# Altium project acopians-hw.PrjPcb
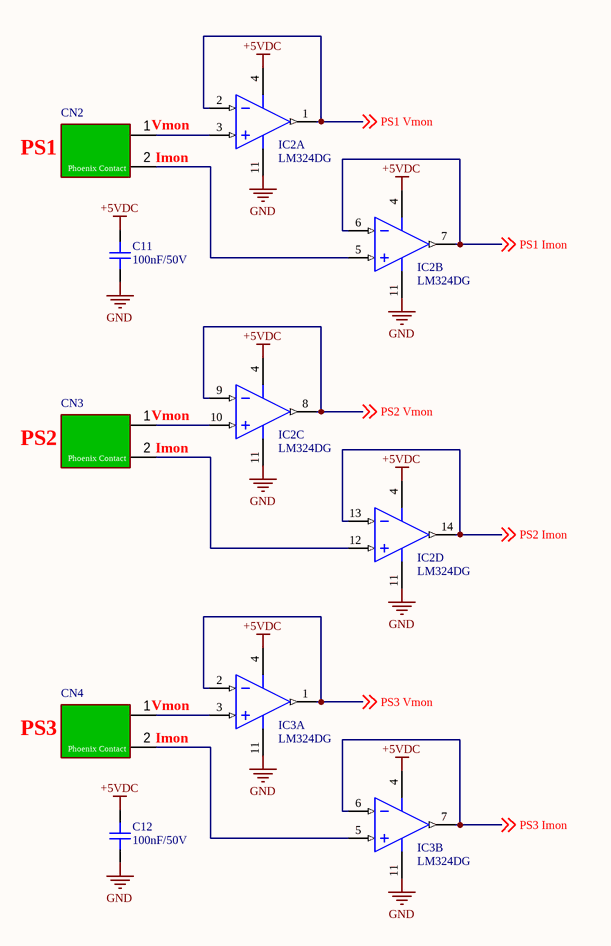
[diagram p0: vmon-and-imon-measurements-hw.SchDoc]
Project Link: =ProjectLink
2 sheets, 25 parts. Net scope: global (net labels, ports and power ports of the same name join across sheets).
Board file: pcb-power-supply-measurement-hw.PcbDoc
Sheets:
  vmon-and-imon-measurements-hw.SchDoc
  outputs-voltage-and-current-measurements-hw.SchDoc

## Sheet vmon-and-imon-measurements-hw.SchDoc
size A4; DrawnBy: Rogério J. M.; Revision: V1.0; SheetNumber: 2; SheetTotal: 5

### Parts
C11  100nF/50V  [C0805]
C12  100nF/50V  [C0805]
CN2  1755736  [Conector Phoenix 2 vias 1755736]  (value not drawn)
CN3  1755736  [Conector Phoenix 2 vias 1755736]  (value not drawn)
CN4  1755736  [Conector Phoenix 2 vias 1755736]  (value not drawn)
IC2  LM324DG  [SOIC-14]  (parts A,B,C,D of 4)
IC3  LM324DG  [SOIC-14]  (parts A,B of 4)

### Nets
+5VDC: C11.2 C12.2 IC2.4(V+) IC3.4(V+)
GND: C11.1 C12.1 IC2.11(V-) IC3.11(V-)
PS1 Imon: IC2.6(IN_B-) IC2.7(OUT_B) ; off-sheet PS1 Imon
PS1 Vmon: IC2.1(OUT_A) IC2.2(IN_A-) ; off-sheet PS1 Vmon
PS2 Imon: IC2.13(IN_D-) IC2.14(OUT_D) ; off-sheet PS2 Imon
PS2 Vmon: IC2.8(OUT_C) IC2.9(IN_C-) ; off-sheet PS2 Vmon
PS3 Imon: IC3.6(IN_B-) IC3.7(OUT_B) ; off-sheet PS3 Imon
PS3 Vmon: IC3.1(OUT_A) IC3.2(IN_A-) ; off-sheet PS3 Vmon
NetCN2_1: CN2.1 IC2.3(IN_A+)
NetCN2_2: CN2.2 IC2.5(IN_B+)
NetCN3_1: CN3.1 IC2.10(IN_C+)
NetCN3_2: CN3.2 IC2.12(IN_D+)
NetCN4_1: CN4.1 IC3.3(IN_A+)
NetCN4_2: CN4.2 IC3.5(IN_B+)

### Notes on the sheet
- PS1
- (near CN2) Vmon
- (near CN2) Imon
- (near CN3) Vmon
- PS2
- (near CN3) Imon
- (near CN4) Vmon
- PS3
- (near CN4) Imon
- Drawn by:
- Title:
- Revision:
- File:
- Date:
- Project:
- Time:
- Variant:
- Sheet
- of
- DAT - INE - EMI
  Eletrônica e
  Microeletrônica
- Copyright CNPEM 2023.
  This documentation describes Open Hardware and is licensed under the CERN OHL S v2. You may redistribute and modify this documentation under the terms of the CERN OHL S v2. (https://www.ohwr.org/cernohl). This documentation is distributed WITHOUT ANY EXPRESS OR IMPLIED WARRANTY, INCLUDING OF MERCHANTABILITY, SATISFACTORY QUALITY AND FITNESS FOR A PARTICULAR PURPOSE. Please see the CERN OHL S v2 for applicable conditions.

### Library data of the parts
C11 C12 = CAPACITOR 100nF/50V: Capacitor 0.1UF 50V X7R 0805; Manufacturer 1: Kyocera AVX; Manufacturer Part Number 1: 08055C104KAZ2A; Description 1: Capacitor Ceramic 0.1uF 50V X7R 10% SMD 0805 FlexiTerm 125C Paper T/R; Category 1: Ceramic Capacitors; Capacitance: 100nF; Tolerance: 10%; Temperature Coefficient: 30ppm/°C; Dissipation Factor: 2.5%; Código LNLS: AP106675; Supplier 1: Arrow Electronics; Supplier Part Number 1: 08055C104KAZ2A; RoHS 1: Yes; Stock 1: 28000; Pricing 1: 4000=0,0262 (USD); Mount: Surface Mount,PCB; Case/Package: 0805; Number of Pins: 2; Case Code (Metric): 2012; Case Code (Imperial): 0805; Min Operating Temperature: -55°C; Max Operating Temperature: 125°C; Packaging: Tape and Reel; Voltage Rating (DC): 50V; Dielectric: X7R; Package Quantity: 4000; Series: FLEXITERM®; Voltage Rating: 50V; Termination: SMD/SMT; Voltage: 50V; Features: Soft Termination; Construction: Flat; Length: 2.01mm; Width: 1.25mm; Height: 0.94mm; Depth: 1.25mm; Reach SVHC Compliant: No; Lead Free: Lead Free; RoHS Compliant: Yes; ComponentLink1URL: https://datasheet.ciiva.com/28613/630895-28613376.pdf?src-supplier=Element14; ComponentLink1Description: https://datasheet.ciiva.com/28613/630895-28613376.pdf?src-supplier=Element14; ComponentLink2URL: https://datasheet.ciiva.com/11788/0900766b80dc2409-11788550.pdf?src-supplier=Rs; ComponentLink2Description: https://datasheet.ciiva.com/11788/0900766b80dc2409-11788550.pdf?src-supplier=Rs; ComponentLink3URL: https://datasheet.ciiva.com/30514/2014094-30514066.pdf?src-supplier=Jameco; ComponentLink3Description: https://datasheet.ciiva.com/30514/2014094-30514066.pdf?src-supplier=Jameco; ComponentLink4URL: https://datasheet.ciiva.com/11499/flexiterm-11499901.pdf?src-supplier=Avnet; ComponentLink4Description: https://datasheet.ciiva.com/11499/flexiterm-11499901.pdf?src-supplier=Avnet; ComponentLink5URL: https://datasheet.ciiva.com/5417/cx7r-218113-5417323.pdf?src-supplier=Mouser; ComponentLink5Description: https://datasheet.ciiva.com/5417/cx7r-218113-5417323.pdf?src-supplier=Mouser; ComponentLink6URL: https://datasheet.ciiva.com/28613/630895-28613368.pdf?src-supplier=Element14; ComponentLink6Description: https://datasheet.ciiva.com/28613/630895-28613368.pdf?src-supplier=Element14; ComponentLink7URL: https://datasheet.ciiva.com/151/flexiterm-151512.pdf?src-supplier=Digi-Key; ComponentLink7Description: https://datasheet.ciiva.com/151/flexiterm-151512.pdf?src-supplier=Digi-Key; ComponentLink8URL: https://datasheet.ciiva.com/151/flexiterm-151513.pdf?src-supplier=Digi-Key; ComponentLink8Description: https://datasheet.ciiva.com/151/flexiterm-151513.pdf?src-supplier=Digi-Key; ComponentLink9URL: https://datasheet.ciiva.com/151/flexiterm-151514.pdf?src-supplier=Digi-Key; ComponentLink9Description: https://datasheet.ciiva.com/151/flexiterm-151514.pdf?src-supplier=Digi-Key; ComponentLink10URL: https://datasheet.ciiva.com/14602/70001075-14602617.pdf?src-supplier=Allied+Electronics; ComponentLink10Description: https://datasheet.ciiva.com/14602/70001075-14602617.pdf?src-supplier=Allied+Electronics; ComponentLink11URL: https://datasheet.ciiva.com/16427/cx7r-16427406.pdf?src-supplier=Future+Electronics; ComponentLink11Description: https://datasheet.ciiva.com/16427/cx7r-16427406.pdf?src-supplier=Future+Electronics
CN2-CN4 = CONECTOR PHOENIX 2 VIAS 1755736: Manufacturer: Phoenix Contact; Number of Positions: 2; Number of Levels: 1; Pitch: 0.200" (5.08mm); Header Orientation: Vertical; Current - IEC: 12A; Voltage - IEC: 630V; Voltage - UL: 300V; Material Flammability Rating: UL94 V-0; Contact Tail Length: 0.154" (3.90mm); Código LNLS: MT101663; Supplier 1: Digi-Key; Manufacturer Part Number: 1755736; RoHS: RoHS Compliant; Category: Connectors, Interconnects; Stock 1: 11008; Pricing 1: 1=0.59, 10=0.564, 50=0.539, 100=0.5243, 250=0.49, 500=0.4508, 1000=0.4165, 2500=0.3969, 5000=0.3724 (USD); Packaging: Bulk; Part Status: Active; Type: Header, Male Pins, Shrouded (4 Side); Positions Per Level: 2; Plug Wire Entry: -; Termination Style: Solder; Mounting Type: Through Hole; Current - UL: 12A; Wire Gauge or Range - AWG: -; Wire Gauge or Range - mm²: -; Color: Green; Operating Temperature: -; Contact Mating Finish: Tin; Features: -; Ingress Protection: -; Screw Size: -; Torque - Screw: -; Wire Strip Length: -; Contact Material: -; Housing Material: Polyamide (PA), Nylon; Insulation Height: 0.472" (12.00mm); ComponentLink1URL: http://media.digikey.com/pdf/Data%20Sheets/Phoenix%20Contact%20PDFs/1755736.pdf; ComponentLink1Description: http://media.digikey.com/pdf/Data%20Sheets/Phoenix%20Contact%20PDFs/1755736.pdf; Supplier Part Number 1: 277-1150-ND
IC2 IC3 = LM324DG: Operational Amplifiers - Op Amps 3-32V Quad 5mV; Manufacturer 1: Texas Instruments; Manufacturer Part Number 1: LM324DG4; Description 1: 4-Channel industry standard operational amplifier 14-SOIC 0 to 70; Category 1: Amplifiers - Op Amps, Buffer, Instrumentation; Operating Supply Voltage: 16V; Voltage Gain: 100dB; Slew Rate: 0.5V/µs; Common Mode Rejection Ratio: 65dB; Number of Channels: 4; Output Current: 30mA; Max Supply Voltage: 32V; Min Supply Voltage: 3V; Min Dual Supply Voltage: 1.5V; Gain Bandwidth Product: 1.2MHz; Input Bias Current: 20nA; Input Offset Voltage (Vos): 3mV; Operating Supply Current: 1.4mA; Output Current per Channel: 60mA; Amplifier Type: GENERAL PURPOSE; Supply Current: 3mA; Código LNLS: MT104472; Supplier 1: Mouser; Supplier Part Number 1: 595-LM324DG4; RoHS 1: Yes; Stock 1: 4026; Pricing 1: 1=0,9, 10=0,761, 50=0,761, 100=0,583, 1000=0,407, 10000=0,381 (USD); Mount: Surface Mount; Case/Package: SOIC; Number of Pins: 14; Min Operating Temperature: 0°C; Max Operating Temperature: 70°C; Package Quantity: 50; Packaging: Rail/Tube; Max Dual Supply Voltage: 16V; Number of Circuits: 4; Bandwidth: 1.2MHz; Technology: BIPOLAR; Radiation Hardening: No; Lead Free: Lead Free; RoHS Compliant: Yes; ComponentLink1URL: https://datasheet.ciiva.com/1811/lm224-1811004.pdf?src-supplier=Digi-Key; ComponentLink1Description: https://datasheet.ciiva.com/1811/lm224-1811004.pdf?src-supplier=Digi-Key

## Sheet outputs-voltage-and-current-measurements-hw.SchDoc
size A4; DrawnBy: Rogério J. M.; Revision: V1.0; SheetNumber: 3; SheetTotal: 5
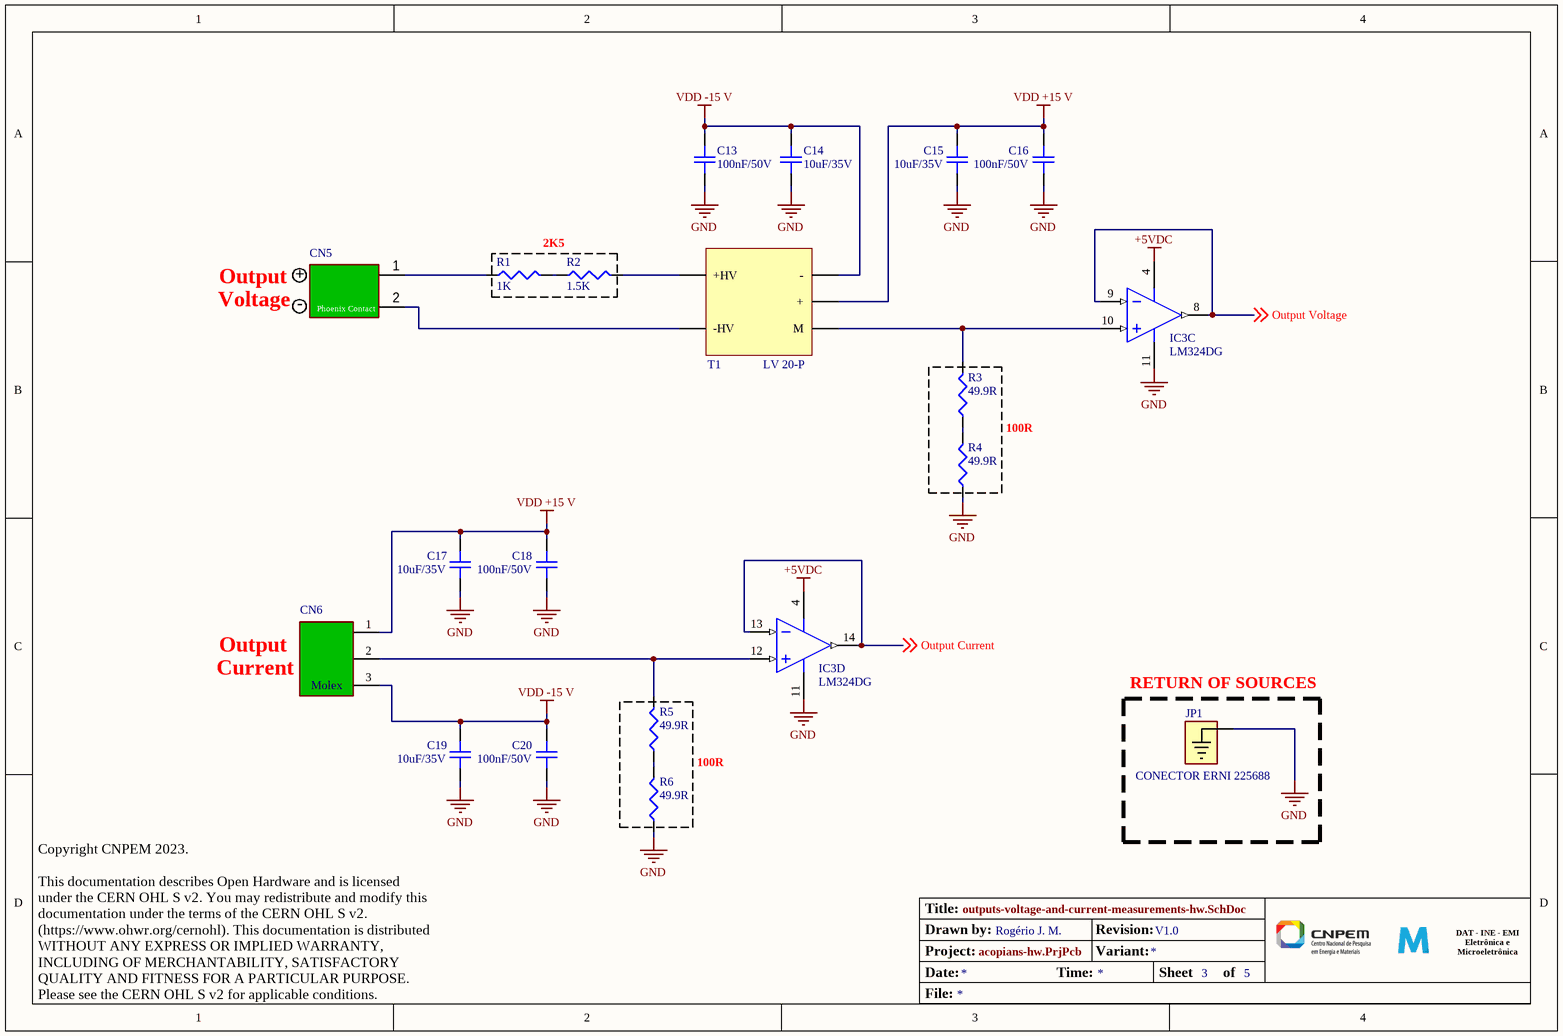
[diagram p1: outputs-voltage-and-current-measurements-hw.SchDoc]

### Parts
C13  100nF/50V  [C0805]
C14  10uF/35V  [C0805]
C15  10uF/35V  [C0805]
C16  100nF/50V  [C0805]
C17  10uF/35V  [C0805]
C18  100nF/50V  [C0805]
C19  10uF/35V  [C0805]
C20  100nF/50V  [C0805]
CN5  1755736  [Conector Phoenix 2 vias 1755736]  (value not drawn)
CN6  Header Molex 3 Pin 22-27-2031  [HEADER MOLEX 22 27 2031]  (value not drawn)
IC3  LM324DG  [SOIC-14]  (parts C,D of 4)
JP1  CONECTOR ERNI 225688  [CONECTOR ERNI 225688]
R1  1K  [R0805]
R2  1.5K  [R0603]
R3  49.9R  [R0603]
R4  49.9R  [R0603]
R5  49.9R  [R0603]
R6  49.9R  [R0603]
T1  Text: LV 20-P  [VOLTAGE TRANSDUCER LV 20-P]  (hidden comment: Voltagem Transducer LV 20-P)

### Blocks framed on the sheet
2K5: R1 R2
RETURN OF SOURCES: JP1

### Nets
+5VDC: IC3.4(V+)
GND: C13.1 C14.1 C15.1 C16.1 C17.1 C18.1 C19.1 C20.1 IC3.11(V-) JP1.1 R4.1 R6.1
VDD +15 V: C15.2 C16.2 C17.2 C18.2 CN6.1(+15V) T1.4(+)
VDD -15 V: C13.2 C14.2 C19.2 C20.2 CN6.3(-15V) T1.3(-)
Output Current: IC3.13(IN_D-) IC3.14(OUT_D) ; off-sheet Output Current
Output Voltage: IC3.8(OUT_C) IC3.9(IN_C-) ; off-sheet Output Voltage
NetCN5_1: CN5.1 R1.1
NetCN5_2: CN5.2 T1.2(-HV)
NetCN6_2: CN6.2(M) IC3.12(IN_D+) R5.2
NetIC3_10: IC3.10(IN_C+) R3.2 T1.5(M)
NetR1_2: R1.2 R2.1
NetR2_2: R2.2 T1.1(+HV)
NetR3_1: R3.1 R4.2
NetR5_1: R5.1 R6.2

### Notes on the sheet
- Voltage
- Output
- +
- -
- 100R
- Current
- Drawn by:
- Title:
- Revision:
- File:
- Date:
- Project:
- Time:
- Variant:
- Sheet
- of
- DAT - INE - EMI
  Eletrônica e
  Microeletrônica
- Copyright CNPEM 2023.
  This documentation describes Open Hardware and is licensed under the CERN OHL S v2. You may redistribute and modify this documentation under the terms of the CERN OHL S v2. (https://www.ohwr.org/cernohl). This documentation is distributed WITHOUT ANY EXPRESS OR IMPLIED WARRANTY, INCLUDING OF MERCHANTABILITY, SATISFACTORY QUALITY AND FITNESS FOR A PARTICULAR PURPOSE. Please see the CERN OHL S v2 for applicable conditions.
- (in symbol HEADER MOLEX 22-27-2031) Molex

### Library data of the parts
C13 C16 C18 C20 = CAPACITOR 100nF/50V: as C11 on sheet vmon-and-imon-measurements-hw; Supplier 1: Arrow Electronics; Supplier Part Number 1: 08055C104KAZ2A; RoHS 1: Yes; Stock 1: 28000; Pricing 1: 4000=0,0262 (USD); Mount: Surface Mount,PCB; Case/Package: 0805; Number of Pins: 2; Case Code (Metric): 2012; Case Code (Imperial): 0805; Min Operating Temperature: -55°C; Max Operating Temperature: 125°C; Packaging: Tape and Reel; Voltage Rating (DC): 50V; Dielectric: X7R; Package Quantity: 4000; Series: FLEXITERM®; Voltage Rating: 50V; Termination: SMD/SMT; Voltage: 50V; Features: Soft Termination; Construction: Flat; Length: 2.01mm; Width: 1.25mm; Height: 0.94mm; Depth: 1.25mm; Reach SVHC Compliant: No; Lead Free: Lead Free; RoHS Compliant: Yes; ComponentLink1URL: https://datasheet.ciiva.com/28613/630895-28613376.pdf?src-supplier=Element14; ComponentLink1Description: https://datasheet.ciiva.com/28613/630895-28613376.pdf?src-supplier=Element14; ComponentLink2URL: https://datasheet.ciiva.com/11788/0900766b80dc2409-11788550.pdf?src-supplier=Rs; ComponentLink2Description: https://datasheet.ciiva.com/11788/0900766b80dc2409-11788550.pdf?src-supplier=Rs; ComponentLink3URL: https://datasheet.ciiva.com/30514/2014094-30514066.pdf?src-supplier=Jameco; ComponentLink3Description: https://datasheet.ciiva.com/30514/2014094-30514066.pdf?src-supplier=Jameco; ComponentLink4URL: https://datasheet.ciiva.com/11499/flexiterm-11499901.pdf?src-supplier=Avnet; ComponentLink4Description: https://datasheet.ciiva.com/11499/flexiterm-11499901.pdf?src-supplier=Avnet; ComponentLink5URL: https://datasheet.ciiva.com/5417/cx7r-218113-5417323.pdf?src-supplier=Mouser; ComponentLink5Description: https://datasheet.ciiva.com/5417/cx7r-218113-5417323.pdf?src-supplier=Mouser; ComponentLink6URL: https://datasheet.ciiva.com/28613/630895-28613368.pdf?src-supplier=Element14; ComponentLink6Description: https://datasheet.ciiva.com/28613/630895-28613368.pdf?src-supplier=Element14; ComponentLink7URL: https://datasheet.ciiva.com/151/flexiterm-151512.pdf?src-supplier=Digi-Key; ComponentLink7Description: https://datasheet.ciiva.com/151/flexiterm-151512.pdf?src-supplier=Digi-Key; ComponentLink8URL: https://datasheet.ciiva.com/151/flexiterm-151513.pdf?src-supplier=Digi-Key; ComponentLink8Description: https://datasheet.ciiva.com/151/flexiterm-151513.pdf?src-supplier=Digi-Key; ComponentLink9URL: https://datasheet.ciiva.com/151/flexiterm-151514.pdf?src-supplier=Digi-Key; ComponentLink9Description: https://datasheet.ciiva.com/151/flexiterm-151514.pdf?src-supplier=Digi-Key; ComponentLink10URL: https://datasheet.ciiva.com/14602/70001075-14602617.pdf?src-supplier=Allied+Electronics; ComponentLink10Description: https://datasheet.ciiva.com/14602/70001075-14602617.pdf?src-supplier=Allied+Electronics; ComponentLink11URL: https://datasheet.ciiva.com/16427/cx7r-16427406.pdf?src-supplier=Future+Electronics; ComponentLink11Description: https://datasheet.ciiva.com/16427/cx7r-16427406.pdf?src-supplier=Future+Electronics
C14 C15 C17 C19 = CAPACITOR 10uF/35V: Capacitor 10UF 35V X5R 0805; Manufacturer: TDK; Manufacturer Part Number: C2012X5R1V106K085AC; Dielectric Material: Ceramic; Tolerance: 10%; Código LNLS: AP105062; Supplier 1: Digi-Key; Stock 1: 56135; Pricing 1: 1=0.73, 10=0.519, 100=0.3416, 500=0.253, 1000=0.2151 (USD); Case/Package: 0805; Weight: 0.000194oz; Case Code (Metric): 2012; Case Code (Imperial): 0805; Min Operating Temperature: -55°C; Max Operating Temperature: 85°C; Package Quantity: 1; Packaging: Tape and Reel; Capacitance: 10uF; Voltage Rating: 35V; Dielectric: X5R; Termination: SMD/SMT; Voltage Rating (DC): 35V; Length: 0.079inch; Height: 0.85mm; Width: 0.049inch; Thickness: 0.039inch; REACH SVHC: No SVHC; Lead Free: Lead Free; ComponentLink1URL: https://datasheet.ciiva.com/14894/tdkmlcccaprange-14894527.pdf; ComponentLink1Description: https://datasheet.ciiva.com/14894/tdkmlcccaprange-14894527.pdf; Supplier Part Number 1: 445-14417-1-ND
CN5 = CONECTOR PHOENIX 2 VIAS 1755736: as CN2 on sheet vmon-and-imon-measurements-hw; Supplier 1: Digi-Key; Manufacturer Part Number: 1755736; RoHS: RoHS Compliant; Category: Connectors, Interconnects; Stock 1: 11008; Pricing 1: 1=0.59, 10=0.564, 50=0.539, 100=0.5243, 250=0.49, 500=0.4508, 1000=0.4165, 2500=0.3969, 5000=0.3724 (USD); Packaging: Bulk; Part Status: Active; Type: Header, Male Pins, Shrouded (4 Side); Positions Per Level: 2; Plug Wire Entry: -; Termination Style: Solder; Mounting Type: Through Hole; Current - UL: 12A; Wire Gauge or Range - AWG: -; Wire Gauge or Range - mm²: -; Color: Green; Operating Temperature: -; Contact Mating Finish: Tin; Features: -; Ingress Protection: -; Screw Size: -; Torque - Screw: -; Wire Strip Length: -; Contact Material: -; Housing Material: Polyamide (PA), Nylon; Insulation Height: 0.472" (12.00mm); ComponentLink1URL: http://media.digikey.com/pdf/Data%20Sheets/Phoenix%20Contact%20PDFs/1755736.pdf; ComponentLink1Description: http://media.digikey.com/pdf/Data%20Sheets/Phoenix%20Contact%20PDFs/1755736.pdf; Supplier Part Number 1: 277-1150-ND
CN6 = HEADER MOLEX 22-27-2031: Manufacturer: Molex, LLC; Manufacturer Part Number: 0022272031; Pitch - Mating: 0.100" (2.54mm); Style: Board to Cable/Wire; Shrouding: Shrouded - 1 Wall; Number of Positions: 3; Number of Positions Loaded: All; Contact Length - Mating: 0.295" (7.49mm); Contact Length - Post: 0.140" (3.56mm); Overall Contact Length: 0.560" (14.22mm); Material Flammability Rating: UL94 V-0; Código LNLS: MT103887; Supplier 1: Digi-Key; RoHS: RoHS Compliant; Category: Connectors, Interconnects; Stock 1: 19040; Pricing 1: 1=0.35, 10=0.334, 25=0.2864, 50=0.2436, 100=0.234, 250=0.21012, 500=0.20056, 1000=0.16713, 2500=0.1528 (USD); Packaging: Bulk; Part Status: Active; Connector Type: Header; Contact Type: Male Pin; Number of Rows: 1; Row Spacing - Mating: -; Mounting Type: Through Hole; Termination: Solder; Fastening Type: Friction Lock; Insulation Height: 0.461" (11.70mm); Contact Shape: Square; Contact Finish - Mating: Tin; Contact Finish Thickness - Mating: 100µin (2.54µm); Contact Finish - Post: Tin; Contact Material: Brass; Insulation Material: Polyamide (PA), Nylon; Features: -; Operating Temperature: -; Ingress Protection: -; Insulation Color: Natural; Current Rating: -; Voltage Rating: -; Mated Stacking Heights: -; Contact Finish Thickness - Post: 100µin (2.54µm); Applications: Automotive, General Purpose, Medical, Telecommunications; ComponentLink1URL: http://www.molex.com/pdm_docs/sd/022272031_sd.pdf; ComponentLink1Description: http://www.molex.com/pdm_docs/sd/022272031_sd.pdf; Supplier Part Number 1: WM4112-ND
IC3 = LM324DG: as IC2 on sheet vmon-and-imon-measurements-hw; Supplier 1: Mouser; Supplier Part Number 1: 595-LM324DG4; RoHS 1: Yes; Stock 1: 4026; Pricing 1: 1=0,9, 10=0,761, 50=0,761, 100=0,583, 1000=0,407, 10000=0,381 (USD); Mount: Surface Mount; Case/Package: SOIC; Number of Pins: 14; Min Operating Temperature: 0°C; Max Operating Temperature: 70°C; Package Quantity: 50; Packaging: Rail/Tube; Max Dual Supply Voltage: 16V; Number of Circuits: 4; Bandwidth: 1.2MHz; Technology: BIPOLAR; Radiation Hardening: No; Lead Free: Lead Free; RoHS Compliant: Yes; ComponentLink1URL: https://datasheet.ciiva.com/1811/lm224-1811004.pdf?src-supplier=Digi-Key; ComponentLink1Description: https://datasheet.ciiva.com/1811/lm224-1811004.pdf?src-supplier=Digi-Key
JP1 = CONECTOR ERNI 225688: Manufacturer 1: TE Connectivity; Manufacturer Part Number 1: 225688-E; Description 1: Conn M4 Threaded Power Connector Receptacle 1 POS ST; Código LNLS: AP109660; Supplier 1: Digi-Key; Supplier Part Number 1: 2684-225688-E-ND; RoHS 1: No; Stock 1: 659; Pricing 1: 1=5,29, 10=4,802, 25=4,548, 50=4,4422, 100=4,2307, 250=3,70184, 500=3,59608, 1000=3,06725, 2500=2,85572 (USD); ComponentLink1Description: https://www.erni.com/fileadmin/import/products/assets/DC0007196.PDF; ComponentLink1URL: https://www.erni.com/fileadmin/import/products/assets/DC0007196.PDF
R1 = RESISTOR 1K: Resistor SMD 1K OHM 0.1% 1/4W 0805; Manufacturer 1: TE Connectivity; Manufacturer Part Number 1: 1-2176092-8; Description 1: SMD Chip Resistor, 1 kOhm, ± 0.1%, 250 mW, 0805 [2012 Metric], Thin Film, High Power Precision; Category 1: Chip SMD Resistors; Resistance: 1kR; Power Rating: 250mW; Temperature Coefficient: 25ppm/°C; Voltage Rating: 150V; Number of Resistors: 1; Código LNLS: MT112491; Supplier 1: Mouser; Supplier Part Number 1: 279-1-2176092-8; RoHS 1: Yes; Stock 1: 12918; Pricing 1: 1=0,55, 10=0,304, 50=0,304, 100=0,252, 1000=0,152, 10000=0,138 (USD); Mount: Surface Mount; Case/Package: 0805; Case Code (Metric): 2012; Case Code (Imperial): 0805; Min Operating Temperature: -55°C; Max Operating Temperature: 155°C; Packaging: Tape and Reel; Tolerance: 0.1%; Resistor Type: Thin Film; Termination: Solder; Series: RP73P, Holsworthy; Voltage Rating (DC): 150V; Number of Terminations: 2; Max Power Dissipation: 250mW; Operating Supply Voltage: 150V; Depth: 1.25mm; RoHS Compliant: Yes; Reach SVHC Compliant: 4186SVHC; Lead Free: 5697LeadFree; ComponentLink1URL: https://datasheet.octopart.com/RP73PF2A1K0BTDF-Tyco-Electronics-datasheet-11516962.pdf?src-supplier=Electro+Sonic; ComponentLink1Description: https://datasheet.octopart.com/RP73PF2A1K0BTDF-Tyco-Electronics-datasheet-11516962.pdf?src-supplier=Electro+Sonic
R2 = RESISTOR 1.5K: Resistor SMD 1.5K OHM 0.1% 1/10W 0603; Manufacturer 1: Panasonic; Manufacturer Part Number 1: ERA-3AEB152V; Description 1: Res Thin Film 0603 1.5K Ohm 0.1% 0.1W ±25ppm/°C Molded SMD Punched Carrier T/R; Category 1: Chip SMD Resistors; Resistance: 1.5kR; Temperature Coefficient: 25ppm/°C; Power Rating: 100mW; Voltage Rating: 75V; Código LNLS: MT103626; Supplier 1: Mouser; Supplier Part Number 1: 667-ERA-3AEB152V; RoHS 1: Yes; Stock 1: 5568; Pricing 1: 1=0,34, 10=0,23, 50=0,23, 100=0,094, 1000=0,05, 10000=0,036 (USD); Mount: Surface Mount; Case/Package: 0603; Number of Pins: 2; Contact Plating: Tin; Case Code (Metric): 1608; Case Code (Imperial): 0603; Size Code: 0603; Min Operating Temperature: -55°C; Max Operating Temperature: 155°C; Tolerance: 0.1%; Resistor Type: Thin Film; Packaging: Tape and Reel; Package Quantity: 1; Number of Terminations: 2; Termination: SMD/SMT; Max Power Dissipation: 100mW; Voltage Rating (DC): 75V; Features: Automotive AEC-Q200; Series: ERA-3A; Resistance Tolerance: 0.1%; Technology: METAL FILM; Length: 1.6mm; Width: 0.8mm; Height: 0.45mm; Depth: 0.8mm; Ratings: AEC-Q200; Radiation Hardening: No; Reach SVHC Compliant: No; Lead Free: Lead Free; RoHS Compliant: Yes; ComponentLink1URL: https://datasheet.ciiva.com/11811/0900766b80beefcc-11811712.pdf?src-supplier=Rs; ComponentLink1Description: https://datasheet.ciiva.com/11811/0900766b80beefcc-11811712.pdf?src-supplier=Rs; ComponentLink2URL: https://datasheet.ciiva.com/29183/450830-da-01-en-widerstand-0603-era-29183764.pdf?src-supplier=Conrad; ComponentLink2Description: https://datasheet.ciiva.com/29183/450830-da-01-en-widerstand-0603-era-29183764.pdf?src-supplier=Conrad; ComponentLink3URL: https://datasheet.ciiva.com/9117/aoa0000ce26-9117365.pdf?src-supplier=Avnet; ComponentLink3Description: https://datasheet.ciiva.com/9117/aoa0000ce26-9117365.pdf?src-supplier=Avnet; ComponentLink4URL: https://datasheet.ciiva.com/5734/485442-5734538.pdf?src-supplier=Farnell; ComponentLink4Description: https://datasheet.ciiva.com/5734/485442-5734538.pdf?src-supplier=Farnell; ComponentLink5URL: https://datasheet.ciiva.com/5734/485442-5734539.pdf?src-supplier=Farnell; ComponentLink5Description: https://datasheet.ciiva.com/5734/485442-5734539.pdf?src-supplier=Farnell; ComponentLink6URL: https://datasheet.ciiva.com/46422/485442-46422565.pdf?src-supplier=Element14; ComponentLink6Description: https://datasheet.ciiva.com/46422/485442-46422565.pdf?src-supplier=Element14; ComponentLink7URL: https://datasheet.ciiva.com/16760/70068849-16760629.pdf?src-supplier=Allied+Electronics; ComponentLink7Description: https://datasheet.ciiva.com/16760/70068849-16760629.pdf?src-supplier=Allied+Electronics; ComponentLink8URL: https://datasheet.ciiva.com/7830/485442-7830591.pdf?src-supplier=Element14; ComponentLink8Description: https://datasheet.ciiva.com/7830/485442-7830591.pdf?src-supplier=Element14; ComponentLink9URL: https://datasheet.ciiva.com/28513/485442-28513834.pdf?src-supplier=Element14; ComponentLink9Description: https://datasheet.ciiva.com/28513/485442-28513834.pdf?src-supplier=Element14; ComponentLink10URL: https://datasheet.ciiva.com/30146/54aoa0000ce26-30146117.pdf?src-supplier=Onlinecomponents.com; ComponentLink10Description: https://datasheet.ciiva.com/30146/54aoa0000ce26-30146117.pdf?src-supplier=Onlinecomponents.com; ComponentLink11URL: https://datasheet.ciiva.com/48530/era-eng-tds-48530507.pdf?src-supplier=Distrelec; ComponentLink11Description: https://datasheet.ciiva.com/48530/era-eng-tds-48530507.pdf?src-supplier=Distrelec
R3-R6 = RESISTOR 49.9R: Resistor SMD 49.9R OHM 0.1% 1/10W 0603; Manufacturer 1: Panasonic; Manufacturer Part Number 1: ERA-3AEB49R9V; Description 1: Res Thin Film 0603 49.9 Ohm 0.1% 1/10W ±25ppm/°C Molded SMD SMD Punched Carrier T/R; Category 1: Chip SMD Resistors; Power Rating: 100mW; Voltage Rating: 150V; Temperature Coefficient: 25ppm/°C; Voltage Rating (DC): 75V; Código LNLS: AP105077; Supplier 1: Mouser; Supplier Part Number 1: 667-ERA-3AEB49R9V; RoHS 1: Yes; Stock 1: 101205; Pricing 1: 1=0,35, 10=0,302, 50=0,302, 100=0,118, 1000=0,049, 10000=0,038 (USD); Mount: Surface Mount; Case/Package: 0603; Number of Pins: 2; Case Code (Metric): 1608; Case Code (Imperial): 0603; Contact Plating: Tin; Min Operating Temperature: -55°C; Max Operating Temperature: 155°C; Resistance: 49.9R; Tolerance: 0.1%; Packaging: Tape and Reel; Package Quantity: 1; Resistor Type: Thin Film; Number of Terminations: 2; Termination: SMD/SMT; Max Power Dissipation: 100mW; Features: Automotive AEC-Q200; Series: ERA-3A; Resistance Tolerance: 0.1%; Technology: METAL FILM; Length: 1.6mm; Width: 0.8mm; Height: 0.45mm; Depth: 0.8mm; Reach SVHC Compliant: No; Lead Free: Lead Free; RoHS Compliant: Yes; ComponentLink1URL: https://datasheet.ciiva.com/30262/54aoa0000ce26-30262586.pdf?src-supplier=Onlinecomponents.com; ComponentLink1Description: https://datasheet.ciiva.com/30262/54aoa0000ce26-30262586.pdf?src-supplier=Onlinecomponents.com
T1 = VOLTAGE TRANSDUCER LV 20-P: Manufacturer: LEM USA Inc.; Sensor Type: Voltage, Closed Loop; Código LNLS: AR102474; Supplier 1: Digi-Key; RoHS: RoHS Compliant; Category: Sensors, Transducers; Stock 1: 348; Pricing 1: 1=45.54, 5=43.47, 10=39.33, 25=36.2252, 50=32.085, 100=31.05 (USD); Part Status: Active; Output Type: Voltage; ComponentLink1URL: http://media.digikey.com/pdf/Data%20Sheets/LEM%20USA%20PDFs/LV%2020-P.pdf; ComponentLink1Description: http://media.digikey.com/pdf/Data%20Sheets/LEM%20USA%20PDFs/LV%2020-P.pdf; Supplier Part Number 1: 398-1020-ND; Manufacturer Part Number: LV 20-P

## Nets that join several sheets
+5VDC: vmon-and-imon-measurements-hw (C11.2 C12.2 IC2.4 IC3.4), outputs-voltage-and-current-measurements-hw (IC3.4)
GND: vmon-and-imon-measurements-hw (C11.1 C12.1 IC2.11 IC3.11), outputs-voltage-and-current-measurements-hw (12 pins)